# EAGLE design femtoBeacon-BT5_r1.0.1 (EAGLE 7.6.0)

## Sheet 1 of 2
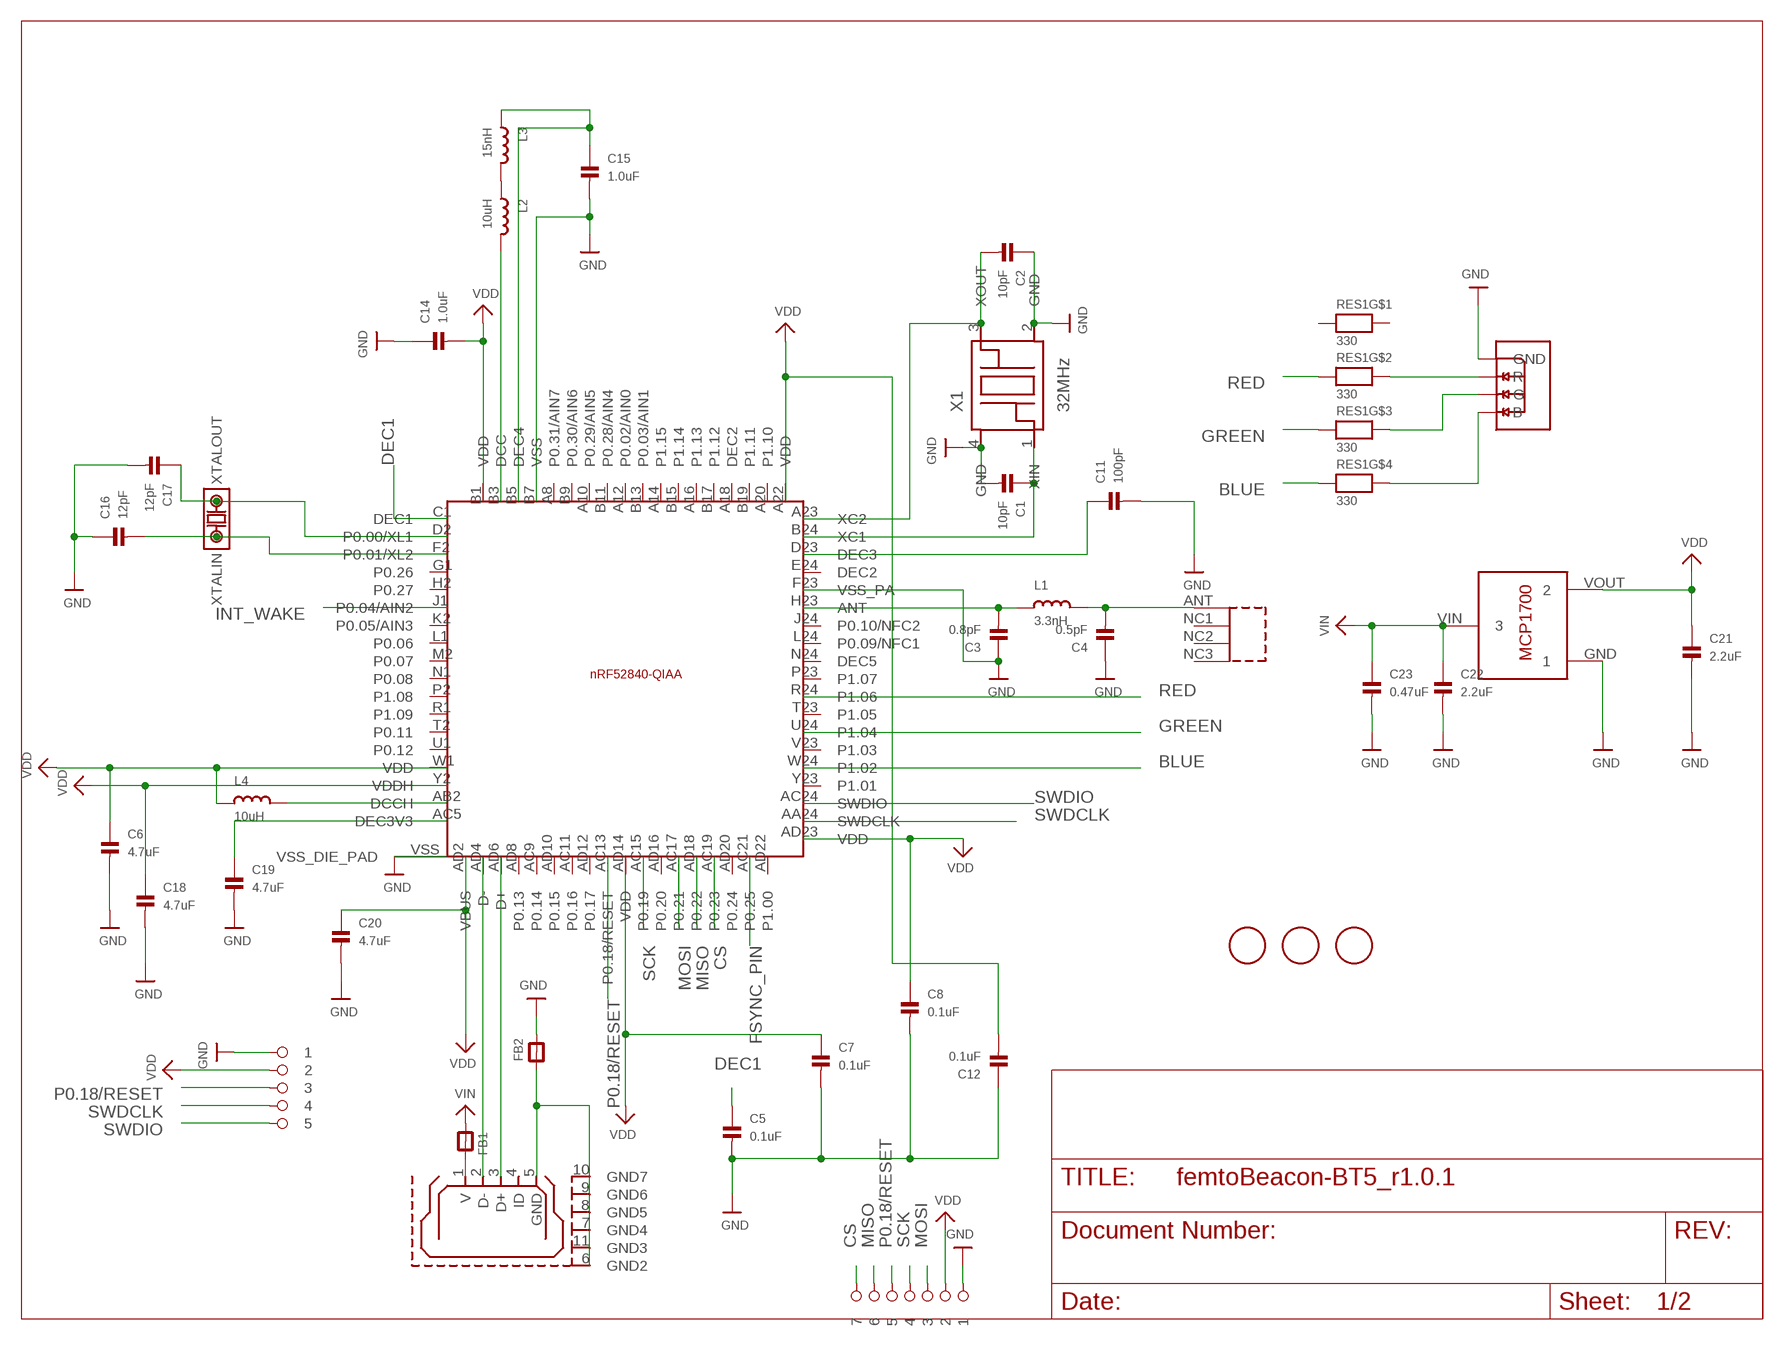
[diagram p0: schematic, sheet 1]

### Parts
ANT  0479480001  [0479480001]
C1  10pF  CAP_CERAMIC_0402MP  [_0402MP]
C2  10pF  CAP_CERAMIC_0402MP  [_0402MP]
C3  0.8pF  CAP_CERAMIC_0402MP  [_0402MP]
C4  0.5pF  CAP_CERAMIC_0402MP  [_0402MP]
C5  0.1uF  CAP_CERAMIC_0402MP  [_0402MP]
C6  4.7uF  CAP_CERAMIC_0402MP  [_0402MP]
C7  0.1uF  CAP_CERAMIC_0402MP  [_0402MP]
C8  0.1uF  CAP_CERAMIC_0402MP  [_0402MP]
C11  100pF  CAP_CERAMIC_0402MP  [_0402MP]
C12  0.1uF  CAP_CERAMIC_0402MP  [_0402MP]
C14  1.0uF  CAP_CERAMIC_0402MP  [_0402MP]
C15  1.0uF  CAP_CERAMIC_0402MP  [_0402MP]
C16  12pF  CAP_CERAMIC_0402MP  [_0402MP]
C17  12pF  CAP_CERAMIC_0402MP  [_0402MP]
C18  4.7uF  CAP_CERAMIC_0402MP  [_0402MP]
C19  4.7uF  CAP_CERAMIC_0402MP  [_0402MP]
C20  4.7uF  CAP_CERAMIC_0402MP  [_0402MP]
C21  2.2uF  CAP_CERAMIC_0402MP  [_0402MP]
C22  2.2uF  CAP_CERAMIC_0402MP  [_0402MP]
C23  0.47uF  CAP_CERAMIC_0402MP  [_0402MP]
FB1  FERRITE_0603MP  [_0603MP]
FB2  FERRITE_0603MP  [_0603MP]
FID1  FIDUCIAL  [FIDUCIAL_1MM]
FID2  FIDUCIAL  [FIDUCIAL_1MM]
FID3  FIDUCIAL  [FIDUCIAL_1MM]
IC  NRF52840  [NRF52840]
L1  3.3nH  INDUCTOR_0402MP  [_0402MP]
L2  10uH  INDUCTOR_0402MP  [_0402MP]
L3  15nH  INDUCTOR_0402MP  [_0402MP]
L4  10uH  INDUCTOR_0402MP  [_0402MP]
LDO_VREG  MCP1700T-3302E/TT  [MCP1700T-3302E/TT]
RES1  330  RESISTOR_4PACK  [RESPACK_4X0603]
U$1  1X5_ROUND  [1X5_ROUND]
U$7  LRTB_R48G  [LRTB_R48G]
U$27  1X7_ROUND  [1X7_ROUND]
USB  USB_MICROB  [USB_MICROB_PACKAGE]
X1  32MHz  FA-128  [FA-128]
X2  32.768kHZ  ABS06-107-32.768KHZ-T  [ABS06-107-32.768KHZ-T]

### Nets
ANT: C3.2 IC.H23(ANT) L1.1
BLUE: IC.W24(P1.02) RES1.4
CS: IC.AC19(P0.23) U$27.P$7 ; also sheet 2
D23: C11.1 IC.D23(DEC3)
DCCH: IC.AB2(DCCH) L4.2
DEC1: C5.1 IC.C1(DEC1)
DEC3V3: C19.1 IC.AC5(DEC3V3)
FSYNC_PIN: IC.AC21(P0.25) ; also sheet 2
GND: C1.2 C2.1 C3.1 C4.1 C5.2 C6.2 C7.2 C8.2 C11.2 C12.1 C14.1 C15.2 C16.1 C17.2 C18.2 C19.2 C20.2 C21.2 C22.2 C23.2 FB2.2 IC.B7(VSS) IC.F23(VSS_PA) IC.VSS(VSS_DIE_PAD) LDO_VREG.GND U$1.P$1 U$7.1(GND) U$27.P$1 X1.2(GND) X1.4(GND) ; also sheet 2
GND_IN: FB2.1 USB.5(GND) USB.6(GND2) USB.7(GND4) USB.8(GND5) USB.9(GND6) USB.10(GND7) USB.11(GND3)
GREEN: IC.U24(P1.04) RES1.3
INT_WAKE: IC.J1(P0.04/AIN2) ; also sheet 2
MISO: IC.AD18(P0.22) U$27.P$6 ; also sheet 2
MOSI: IC.AC17(P0.21) U$27.P$3 ; also sheet 2
N$1: FB1.2 USB.1(V)
N$12: RES1.5 U$7.4(B)
N$13: RES1.6 U$7.3(G)
N$14: RES1.7 U$7.2(R)
N$20: IC.B3(DCC) L2.2
N$21: L2.1 L3.2
N$22: C15.1 IC.B5(DEC4) L3.1
P0.18/RESET: IC.AC13(P0.18/RESET) U$1.P$3 U$27.P$5
RED: IC.R24(P1.06) RES1.2
RF: ANT.ANT C4.2 L1.2
SCK: IC.AC15(P0.19) U$27.P$4 ; also sheet 2
SWDCLK: IC.AA24(SWDCLK) U$1.P$4
SWDIO: IC.AC24(SWDIO) U$1.P$5
USB_DM: IC.AD4(D-) USB.2(D-)
USB_DP: IC.AD6(D+) USB.3(D+)
VDD: C6.1 C7.1 C8.1 C12.2 C14.2 C18.1 C20.1 C21.1 IC.A22(VDD) IC.AD2(VBUS) IC.AD14(VDD) IC.AD23(VDD) IC.B1(VDD) IC.W1(VDD) IC.Y2(VDDH) L4.1 LDO_VREG.VOUT U$1.P$2 U$27.P$2 ; also sheet 2
VIN: C22.1 C23.1 FB1.1 LDO_VREG.VIN
XC1: C1.1 IC.B24(XC1) X1.1(XIN)
XC2: C2.2 IC.A23(XC2) X1.3(XOUT)
XL1: C17.1 IC.D2(P0.00/XL1) X2.2(XTALOUT)
XL2: C16.2 IC.F2(P0.01/XL2) X2.1(XTALIN)
Unconnected: ANT.NC1 ANT.NC2 ANT.NC3 IC.A8(P0.31/AIN7) IC.A10(P0.29/AIN5) IC.A12(P0.02/AIN0) IC.A14(P1.15) IC.A16(P1.13) IC.A18(DEC2) IC.A20(P1.10) IC.AC9(P0.14) IC.AC11(P0.16) IC.AD8(P0.13) IC.AD10(P0.15) IC.AD12(P0.17) IC.AD16(P0.20) IC.AD20(P0.24) IC.AD22(P1.00) IC.B9(P0.30/AIN6) IC.B11(P0.28/AIN4) IC.B13(P0.03/AIN1) IC.B15(P1.14) IC.B17(P1.12) IC.B19(P1.11) IC.E24(DEC2) IC.G1(P0.26) IC.H2(P0.27) IC.J24(P0.10/NFC2) IC.K2(P0.05/AIN3) IC.L1(P0.06) IC.L24(P0.09/NFC1) IC.M2(P0.07) IC.N1(P0.08) IC.N24(DEC5) IC.P2(P1.08) IC.P23(P1.07) IC.R1(P1.09) IC.T2(P0.11) IC.T23(P1.05) IC.U1(P0.12) IC.V23(P1.03) IC.Y23(P1.01) RES1.1 RES1.8 USB.4(ID)

## Sheet 2 of 2
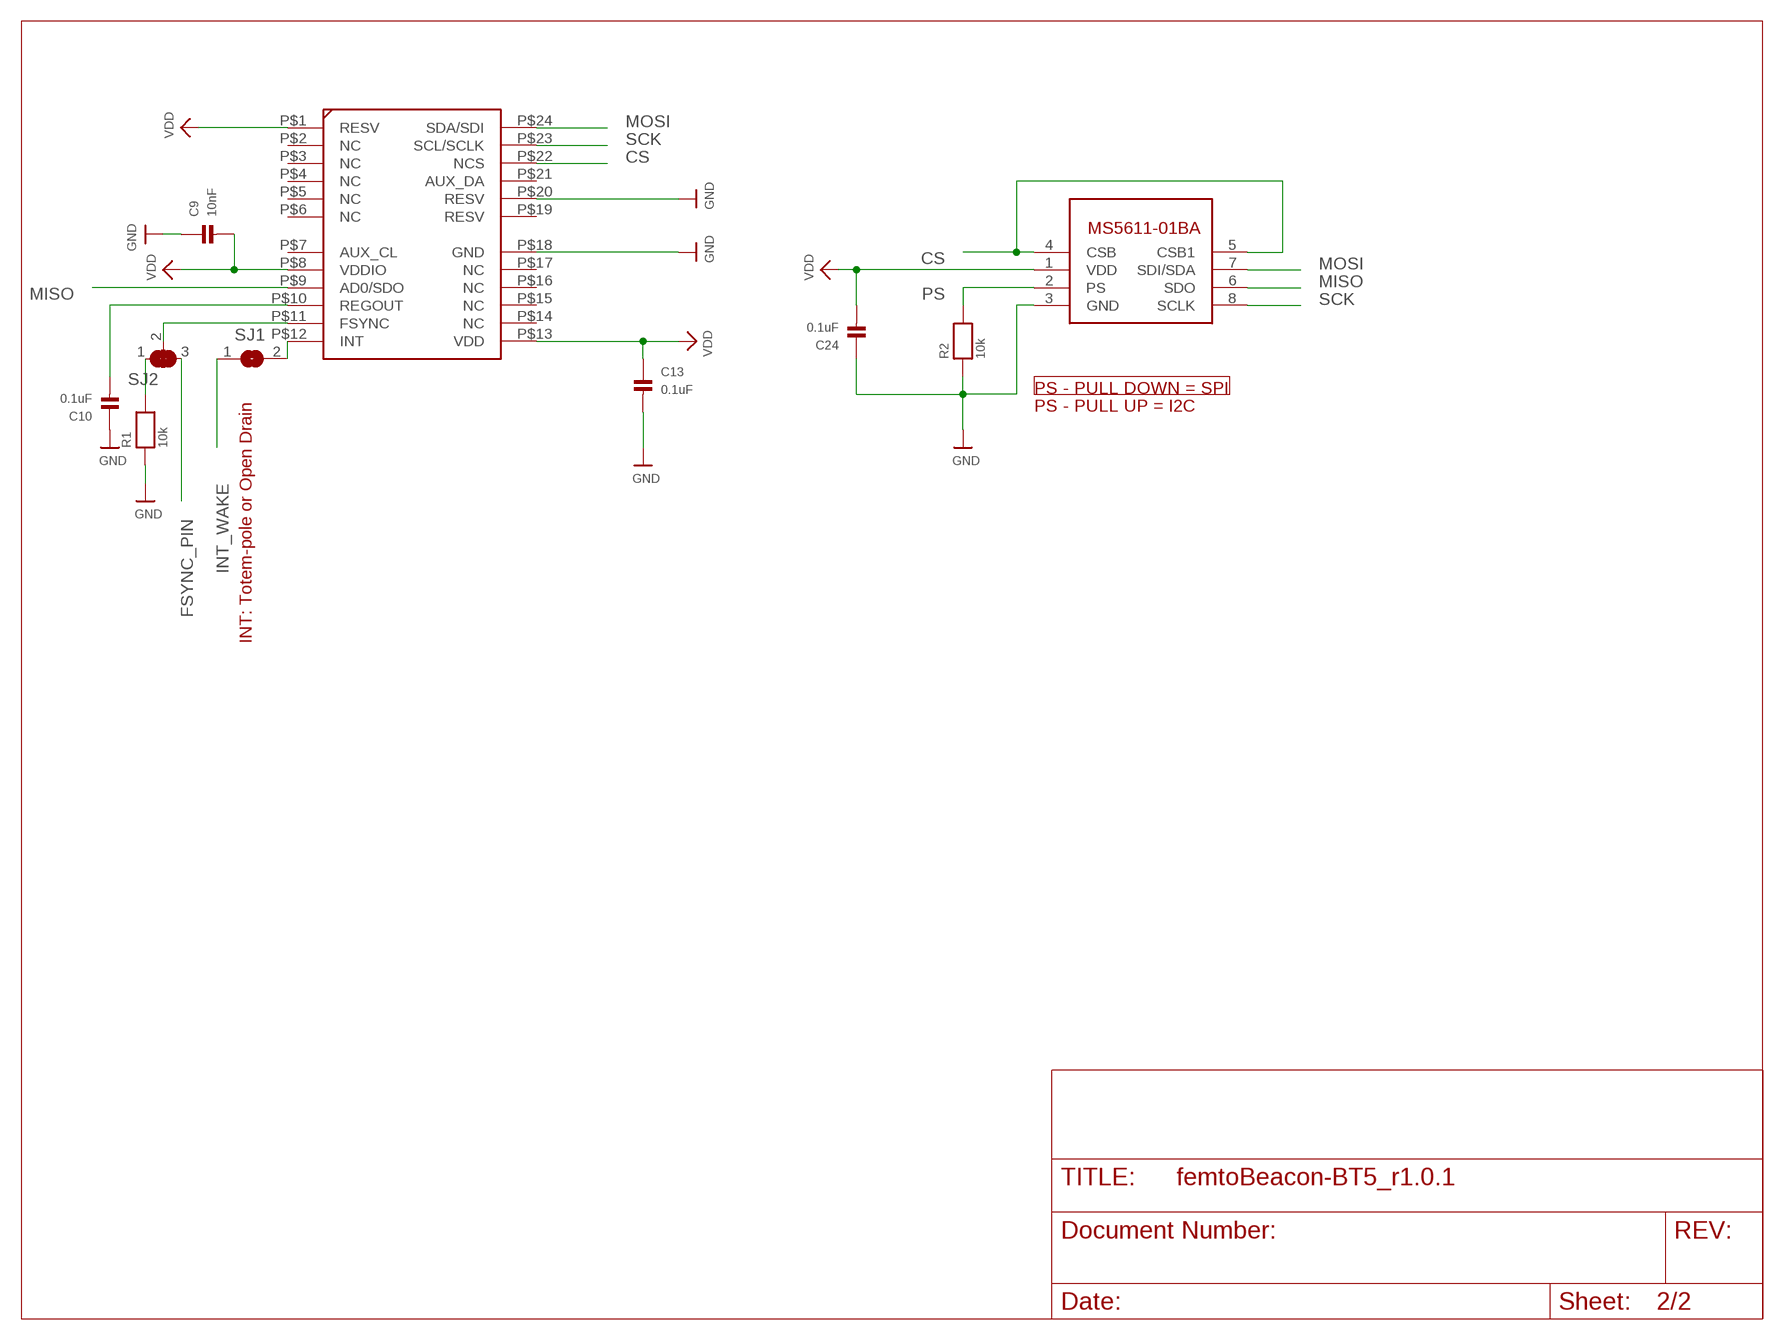
[diagram p1: schematic, sheet 2]

### Parts
BARO  MS5611-01BA03  [MS5611-01BA03]
C9  10nF  CAP_CERAMIC_0402MP  [_0402MP]
C10  0.1uF  CAP_CERAMIC_0402MP  [_0402MP]
C13  0.1uF  CAP_CERAMIC_0402MP  [_0402MP]
C24  0.1uF  CAP_CERAMIC_0402MP  [_0402MP]
IMU  MPU-9250  [QFN_3X3MM]
R1  10k  RESISTOR_0402MP  [_0402MP]
R2  10k  RESISTOR_0402MP  [_0402MP]
SJ1  SOLDERJUMPERCLOSED  [SOLDERJUMPER_CLOSEDWIRE]
SJ2  SOLDERJUMPER_2WAY  [SOLDERJUMPER_2WAY_OPEN_NOPASTE]

### Nets
CS: BARO.4(CSB) BARO.5(CSB1) IMU.P$22(NCS) ; also sheet 1
FSYNC: IMU.P$11(FSYNC) SJ2.2
FSYNC_PIN: SJ2.3 ; also sheet 1
GND: BARO.3(GND) C9.1 C10.1 C13.2 C24.1 IMU.P$18(GND) IMU.P$20(RESV) R1.1 R2.1 ; also sheet 1
INT: IMU.P$12(INT) SJ1.2
INT_WAKE: SJ1.1 ; also sheet 1
MISO: BARO.6(SDO) IMU.P$9(AD0/SDO) ; also sheet 1
MOSI: BARO.7(SDI/SDA) IMU.P$24(SDA/SDI) ; also sheet 1
N$23: R1.2 SJ2.1
N$25: C10.2 IMU.P$10(REGOUT)
PS: BARO.2(PS) R2.2
SCK: BARO.8(SCLK) IMU.P$23(SCL/SCLK) ; also sheet 1
VDD: BARO.1(VDD) C9.2 C13.1 C24.2 IMU.P$1(RESV) IMU.P$8(VDDIO) IMU.P$13(VDD) ; also sheet 1
Unconnected: IMU.P$2(NC) IMU.P$3(NC) IMU.P$4(NC) IMU.P$5(NC) IMU.P$6(NC) IMU.P$7(AUX_CL) IMU.P$14(NC) IMU.P$15(NC) IMU.P$16(NC) IMU.P$17(NC) IMU.P$19(RESV) IMU.P$21(AUX_DA)

### Notes on the sheet
- PS - PULL DOWN = SPI
- PS - PULL UP = I2C
- INT: Totem-pole or Open Drain

## Library data of the parts
ANT = molex-antenna-2.4GHz:0479480001
BARO = freeimu:MS5611-01BA03
C1 C2 C9 C10 C13 C16 C17 C24 = microbuilder:CAP_CERAMIC: Ceramic Capacitors 0402 - 0402 Surface Mount Capacitors 16pF 50V 5% [Digikey: 445-4899-2-ND] 18pF 50V 5% [Digikey: 490-1281-2-ND] 22pF 50V 5% [Digikey: 490-1283-2-ND] 68pF 50V 5% [Digikey: 490-1289-2-ND] 0.1uF 10V 10% [Digikey: 490-1318-2-ND] 1.0uF 6.3V 10% [Digikey: 490-1320-2-ND] 0603 - 0603 Surface Mount Capacitors 16 pF 50V 5% [Digikey: 445-5051-2-ND] 22 pF 50V [Digikey: PCC220ACVTR-ND] 33 pF 50V 5% [Digikey: 490-1415-1-ND] 56pF 50V 5% [Digikey: 490-1421-1-ND] 220pF 50V 5% [Digikey: 445-1285-1-ND] 680 pF 50V 2200 pF 50V 5% C0G [Digikey: 445-1297-1-ND] 5600 pF 100V 5% X7R [Digikey: 478-3711-1-ND] 0.1 µF 25V 10% [Digikey: PCC2277TR-ND] 0.22 µF 16V 10% X7R [Digikey: 445-1318-1-ND] 1.0 µF 25V 10% [Digikey: 445-5146-2-ND] 0603 - RF Specific 3pF 250V +/-0.1pF RF [Digikey: 712-1347-1-ND] 18 pF 250V 5% [Digikey: 478-3505-1-ND or 712-1322-1-ND] 56 pF 250V 5% C0G RF [Digikey: 490-4867-1-ND] 68 pF 250V RF [Digikey: 490-4868-1-ND] 0805 - 0805 Surface Mount Capacitors 220 pF 250V 2% RF Ceramic Capacitor [Digikey: 712-1398-1-ND] 1000 pF 50V 2% NP0 Ceramic Capacitor [Digikey: 478-3760-1-ND] 0.1 µF 25V 10% Ceramic Capacitor [Digikey: PCC1828TR-ND] 1.0 µF 16V 10% Ceramic Capacitor[Digikey: 490-1691-2-ND] 10.0 µF 10V 10% Ceramic Capacitor[Digikey: 709-1228-1-ND] 10.0 uF 16V 10% Ceramic Capacitor [Digikey: 478-5165-2-ND] 47 uF 6.3V 20% Ceramic Capacitor [Digikey: 587-1779-1-ND or 399-5506-1-ND] 1206 - 1206 Surface Mount Capacitors 47uF 10V 20% Ceramic Capacitor [Digikey: 490-5528-1-ND or 399-5508-1-ND or 445-6010-1-ND] 100uF 6.3V -20%, +80% Y5V Ceramic Capacitor (Digikey: 490-4512-1-ND, Mouser: 81-GRM31CF50J107ZE1L); TOL: NP0, ±2%
C3 C11 = microbuilder:CAP_CERAMIC: Ceramic Capacitors 0402 - 0402 Surface Mount Capacitors 16pF 50V 5% [Digikey: 445-4899-2-ND] 18pF 50V 5% [Digikey: 490-1281-2-ND] 22pF 50V 5% [Digikey: 490-1283-2-ND] 68pF 50V 5% [Digikey: 490-1289-2-ND] 0.1uF 10V 10% [Digikey: 490-1318-2-ND] 1.0uF 6.3V 10% [Digikey: 490-1320-2-ND] 0603 - 0603 Surface Mount Capacitors 16 pF 50V 5% [Digikey: 445-5051-2-ND] 22 pF 50V [Digikey: PCC220ACVTR-ND] 33 pF 50V 5% [Digikey: 490-1415-1-ND] 56pF 50V 5% [Digikey: 490-1421-1-ND] 220pF 50V 5% [Digikey: 445-1285-1-ND] 680 pF 50V 2200 pF 50V 5% C0G [Digikey: 445-1297-1-ND] 5600 pF 100V 5% X7R [Digikey: 478-3711-1-ND] 0.1 µF 25V 10% [Digikey: PCC2277TR-ND] 0.22 µF 16V 10% X7R [Digikey: 445-1318-1-ND] 1.0 µF 25V 10% [Digikey: 445-5146-2-ND] 0603 - RF Specific 3pF 250V +/-0.1pF RF [Digikey: 712-1347-1-ND] 18 pF 250V 5% [Digikey: 478-3505-1-ND or 712-1322-1-ND] 56 pF 250V 5% C0G RF [Digikey: 490-4867-1-ND] 68 pF 250V RF [Digikey: 490-4868-1-ND] 0805 - 0805 Surface Mount Capacitors 220 pF 250V 2% RF Ceramic Capacitor [Digikey: 712-1398-1-ND] 1000 pF 50V 2% NP0 Ceramic Capacitor [Digikey: 478-3760-1-ND] 0.1 µF 25V 10% Ceramic Capacitor [Digikey: PCC1828TR-ND] 1.0 µF 16V 10% Ceramic Capacitor[Digikey: 490-1691-2-ND] 10.0 µF 10V 10% Ceramic Capacitor[Digikey: 709-1228-1-ND] 10.0 uF 16V 10% Ceramic Capacitor [Digikey: 478-5165-2-ND] 47 uF 6.3V 20% Ceramic Capacitor [Digikey: 587-1779-1-ND or 399-5506-1-ND] 1206 - 1206 Surface Mount Capacitors 47uF 10V 20% Ceramic Capacitor [Digikey: 490-5528-1-ND or 399-5508-1-ND or 445-6010-1-ND] 100uF 6.3V -20%, +80% Y5V Ceramic Capacitor (Digikey: 490-4512-1-ND, Mouser: 81-GRM31CF50J107ZE1L); TOL: NP0, ±5%
C4 = microbuilder:CAP_CERAMIC: Ceramic Capacitors 0402 - 0402 Surface Mount Capacitors 16pF 50V 5% [Digikey: 445-4899-2-ND] 18pF 50V 5% [Digikey: 490-1281-2-ND] 22pF 50V 5% [Digikey: 490-1283-2-ND] 68pF 50V 5% [Digikey: 490-1289-2-ND] 0.1uF 10V 10% [Digikey: 490-1318-2-ND] 1.0uF 6.3V 10% [Digikey: 490-1320-2-ND] 0603 - 0603 Surface Mount Capacitors 16 pF 50V 5% [Digikey: 445-5051-2-ND] 22 pF 50V [Digikey: PCC220ACVTR-ND] 33 pF 50V 5% [Digikey: 490-1415-1-ND] 56pF 50V 5% [Digikey: 490-1421-1-ND] 220pF 50V 5% [Digikey: 445-1285-1-ND] 680 pF 50V 2200 pF 50V 5% C0G [Digikey: 445-1297-1-ND] 5600 pF 100V 5% X7R [Digikey: 478-3711-1-ND] 0.1 µF 25V 10% [Digikey: PCC2277TR-ND] 0.22 µF 16V 10% X7R [Digikey: 445-1318-1-ND] 1.0 µF 25V 10% [Digikey: 445-5146-2-ND] 0603 - RF Specific 3pF 250V +/-0.1pF RF [Digikey: 712-1347-1-ND] 18 pF 250V 5% [Digikey: 478-3505-1-ND or 712-1322-1-ND] 56 pF 250V 5% C0G RF [Digikey: 490-4867-1-ND] 68 pF 250V RF [Digikey: 490-4868-1-ND] 0805 - 0805 Surface Mount Capacitors 220 pF 250V 2% RF Ceramic Capacitor [Digikey: 712-1398-1-ND] 1000 pF 50V 2% NP0 Ceramic Capacitor [Digikey: 478-3760-1-ND] 0.1 µF 25V 10% Ceramic Capacitor [Digikey: PCC1828TR-ND] 1.0 µF 16V 10% Ceramic Capacitor[Digikey: 490-1691-2-ND] 10.0 µF 10V 10% Ceramic Capacitor[Digikey: 709-1228-1-ND] 10.0 uF 16V 10% Ceramic Capacitor [Digikey: 478-5165-2-ND] 47 uF 6.3V 20% Ceramic Capacitor [Digikey: 587-1779-1-ND or 399-5506-1-ND] 1206 - 1206 Surface Mount Capacitors 47uF 10V 20% Ceramic Capacitor [Digikey: 490-5528-1-ND or 399-5508-1-ND or 445-6010-1-ND] 100uF 6.3V -20%, +80% Y5V Ceramic Capacitor (Digikey: 490-4512-1-ND, Mouser: 81-GRM31CF50J107ZE1L); TOL: NP0, ±10%
C5 C7 C8 C12 C18 C19 C21-C23 = microbuilder:CAP_CERAMIC: Ceramic Capacitors 0402 - 0402 Surface Mount Capacitors 16pF 50V 5% [Digikey: 445-4899-2-ND] 18pF 50V 5% [Digikey: 490-1281-2-ND] 22pF 50V 5% [Digikey: 490-1283-2-ND] 68pF 50V 5% [Digikey: 490-1289-2-ND] 0.1uF 10V 10% [Digikey: 490-1318-2-ND] 1.0uF 6.3V 10% [Digikey: 490-1320-2-ND] 0603 - 0603 Surface Mount Capacitors 16 pF 50V 5% [Digikey: 445-5051-2-ND] 22 pF 50V [Digikey: PCC220ACVTR-ND] 33 pF 50V 5% [Digikey: 490-1415-1-ND] 56pF 50V 5% [Digikey: 490-1421-1-ND] 220pF 50V 5% [Digikey: 445-1285-1-ND] 680 pF 50V 2200 pF 50V 5% C0G [Digikey: 445-1297-1-ND] 5600 pF 100V 5% X7R [Digikey: 478-3711-1-ND] 0.1 µF 25V 10% [Digikey: PCC2277TR-ND] 0.22 µF 16V 10% X7R [Digikey: 445-1318-1-ND] 1.0 µF 25V 10% [Digikey: 445-5146-2-ND] 0603 - RF Specific 3pF 250V +/-0.1pF RF [Digikey: 712-1347-1-ND] 18 pF 250V 5% [Digikey: 478-3505-1-ND or 712-1322-1-ND] 56 pF 250V 5% C0G RF [Digikey: 490-4867-1-ND] 68 pF 250V RF [Digikey: 490-4868-1-ND] 0805 - 0805 Surface Mount Capacitors 220 pF 250V 2% RF Ceramic Capacitor [Digikey: 712-1398-1-ND] 1000 pF 50V 2% NP0 Ceramic Capacitor [Digikey: 478-3760-1-ND] 0.1 µF 25V 10% Ceramic Capacitor [Digikey: PCC1828TR-ND] 1.0 µF 16V 10% Ceramic Capacitor[Digikey: 490-1691-2-ND] 10.0 µF 10V 10% Ceramic Capacitor[Digikey: 709-1228-1-ND] 10.0 uF 16V 10% Ceramic Capacitor [Digikey: 478-5165-2-ND] 47 uF 6.3V 20% Ceramic Capacitor [Digikey: 587-1779-1-ND or 399-5506-1-ND] 1206 - 1206 Surface Mount Capacitors 47uF 10V 20% Ceramic Capacitor [Digikey: 490-5528-1-ND or 399-5508-1-ND or 445-6010-1-ND] 100uF 6.3V -20%, +80% Y5V Ceramic Capacitor (Digikey: 490-4512-1-ND, Mouser: 81-GRM31CF50J107ZE1L)
C6 C14 C15 C20 = microbuilder:CAP_CERAMIC: Ceramic Capacitors 0402 - 0402 Surface Mount Capacitors 16pF 50V 5% [Digikey: 445-4899-2-ND] 18pF 50V 5% [Digikey: 490-1281-2-ND] 22pF 50V 5% [Digikey: 490-1283-2-ND] 68pF 50V 5% [Digikey: 490-1289-2-ND] 0.1uF 10V 10% [Digikey: 490-1318-2-ND] 1.0uF 6.3V 10% [Digikey: 490-1320-2-ND] 0603 - 0603 Surface Mount Capacitors 16 pF 50V 5% [Digikey: 445-5051-2-ND] 22 pF 50V [Digikey: PCC220ACVTR-ND] 33 pF 50V 5% [Digikey: 490-1415-1-ND] 56pF 50V 5% [Digikey: 490-1421-1-ND] 220pF 50V 5% [Digikey: 445-1285-1-ND] 680 pF 50V 2200 pF 50V 5% C0G [Digikey: 445-1297-1-ND] 5600 pF 100V 5% X7R [Digikey: 478-3711-1-ND] 0.1 µF 25V 10% [Digikey: PCC2277TR-ND] 0.22 µF 16V 10% X7R [Digikey: 445-1318-1-ND] 1.0 µF 25V 10% [Digikey: 445-5146-2-ND] 0603 - RF Specific 3pF 250V +/-0.1pF RF [Digikey: 712-1347-1-ND] 18 pF 250V 5% [Digikey: 478-3505-1-ND or 712-1322-1-ND] 56 pF 250V 5% C0G RF [Digikey: 490-4867-1-ND] 68 pF 250V RF [Digikey: 490-4868-1-ND] 0805 - 0805 Surface Mount Capacitors 220 pF 250V 2% RF Ceramic Capacitor [Digikey: 712-1398-1-ND] 1000 pF 50V 2% NP0 Ceramic Capacitor [Digikey: 478-3760-1-ND] 0.1 µF 25V 10% Ceramic Capacitor [Digikey: PCC1828TR-ND] 1.0 µF 16V 10% Ceramic Capacitor[Digikey: 490-1691-2-ND] 10.0 µF 10V 10% Ceramic Capacitor[Digikey: 709-1228-1-ND] 10.0 uF 16V 10% Ceramic Capacitor [Digikey: 478-5165-2-ND] 47 uF 6.3V 20% Ceramic Capacitor [Digikey: 587-1779-1-ND or 399-5506-1-ND] 1206 - 1206 Surface Mount Capacitors 47uF 10V 20% Ceramic Capacitor [Digikey: 490-5528-1-ND or 399-5508-1-ND or 445-6010-1-ND] 100uF 6.3V -20%, +80% Y5V Ceramic Capacitor (Digikey: 490-4512-1-ND, Mouser: 81-GRM31CF50J107ZE1L); TOL: X7R, ±10%
FB1 FB2 = microbuilder:FERRITE: Ferrite Bead 0603 MMZ1608B121C - 120 Ohm @ 100MHz, 600mA, 0.15 Ohm DC Resistance - Digikey: 445-2164-1-ND BK1608HW121-T - 120 Ohm, 600mA Ferrite Chip - Digikey: 587-1876-2-ND 0805 HZ0805B272R-10 - 2.7K Ohm @ 100MHz, 200mA, 0.8 Ohm DC Resistance - Digikey: 240-2504-1-ND (see also Murata BLM21BD272SN1L) MMZ2012Y152B - 1.5K Ohm @ 100MHz, 500mA, 0.4 Ohm DC Resistance - Digikey: 445-1560-1-ND - Mainly for high frequency (80-400MHz) MMZ2012R102A - 1K Ohm @ 100MHz, 500mA, 0.3 Ohm DC Resistance - Digikey: 445-1555-2-ND - More general purpose (10-200MHz)
FID1-FID3 = adafruit:FIDUCIAL: For use by pick and place machines to calibrate the vision/machine, 1mm By microbuilder.eu
IC = Nordic_NRF52840:NRF52840
IMU = mpu9250:MPU-9250
L1 = microbuilder:INDUCTOR: Inductors 0603: 10nH Ceramic Inductor - microwire antenna/RF (Digikey: 712-1434-2-ND) 0805: 560nH Ceramic Inductor - RF (Digikey: 553-1047-1-ND) 270nH Ceramic Inductor - Q = 40@250MHz, +-5%, 1 Ohm DC Resistance (Digikey: 535-10506-2-ND) 1007 (2518 Metric) SMT: 10µH 10% 250mOhm 820mA 1007 Inductor (Digikey: 587-2189-1-ND) 22µH 10% 500mOhm 580mA 1007 Inductor (Digikey: 587-2190-1-ND) 47µH 10% 950mOhm 420mA 1007 Inductor (Digikey: 587-2191-1-ND) 47µH 5% 100mOhm 1A 1008 Inductor (Digikey: 732-1816-1-ND) 5.0x5.0mm (Taiyo Yuden NR5040 Series) 6.8µH 20% 2.3A 64mOhm Inductor (Digikey: 587-2374-2-ND) 5.0x5.0mm (TDK VLC5045 Series) 4.7µH 20% 3.3A 34mOhm Inductor (Digikey: 445-6526-1-ND) 6.8µH 20% 2.7A 46mOhm Inductor (Digikey: 445-6527-1-ND) 6.0x6.0mm (TDK VLC6045 Series) 4.7µH 20% 3.8A 27mOhm Inductor (Digikey: 445-6538-2-ND) 6.8µH 20% 3A 41mOhm Inductor (Digikey: 445-6540-1-ND) 6.2µH 30% 2.2A 45mOhm Inductor (Digikey: SRR5028-6R2YCT-ND) - Not TDK VLC6045 but footprint should match 6.0x6.0mm (TDK SLF6045 Series) 6.8uH 30% 2A 33mOhm Inductor (Digikey: 445-4572-1-ND, Mouser: 810-SLF645T6R8N2R0PF); TOL: ±5%
L2 = microbuilder:INDUCTOR: Inductors 0603: 10nH Ceramic Inductor - microwire antenna/RF (Digikey: 712-1434-2-ND) 0805: 560nH Ceramic Inductor - RF (Digikey: 553-1047-1-ND) 270nH Ceramic Inductor - Q = 40@250MHz, +-5%, 1 Ohm DC Resistance (Digikey: 535-10506-2-ND) 1007 (2518 Metric) SMT: 10µH 10% 250mOhm 820mA 1007 Inductor (Digikey: 587-2189-1-ND) 22µH 10% 500mOhm 580mA 1007 Inductor (Digikey: 587-2190-1-ND) 47µH 10% 950mOhm 420mA 1007 Inductor (Digikey: 587-2191-1-ND) 47µH 5% 100mOhm 1A 1008 Inductor (Digikey: 732-1816-1-ND) 5.0x5.0mm (Taiyo Yuden NR5040 Series) 6.8µH 20% 2.3A 64mOhm Inductor (Digikey: 587-2374-2-ND) 5.0x5.0mm (TDK VLC5045 Series) 4.7µH 20% 3.3A 34mOhm Inductor (Digikey: 445-6526-1-ND) 6.8µH 20% 2.7A 46mOhm Inductor (Digikey: 445-6527-1-ND) 6.0x6.0mm (TDK VLC6045 Series) 4.7µH 20% 3.8A 27mOhm Inductor (Digikey: 445-6538-2-ND) 6.8µH 20% 3A 41mOhm Inductor (Digikey: 445-6540-1-ND) 6.2µH 30% 2.2A 45mOhm Inductor (Digikey: SRR5028-6R2YCT-ND) - Not TDK VLC6045 but footprint should match 6.0x6.0mm (TDK SLF6045 Series) 6.8uH 30% 2A 33mOhm Inductor (Digikey: 445-4572-1-ND, Mouser: 810-SLF645T6R8N2R0PF); TOL: Chip inductor, IDC min = 50 mA, ±20%
L3 = microbuilder:INDUCTOR: Inductors 0603: 10nH Ceramic Inductor - microwire antenna/RF (Digikey: 712-1434-2-ND) 0805: 560nH Ceramic Inductor - RF (Digikey: 553-1047-1-ND) 270nH Ceramic Inductor - Q = 40@250MHz, +-5%, 1 Ohm DC Resistance (Digikey: 535-10506-2-ND) 1007 (2518 Metric) SMT: 10µH 10% 250mOhm 820mA 1007 Inductor (Digikey: 587-2189-1-ND) 22µH 10% 500mOhm 580mA 1007 Inductor (Digikey: 587-2190-1-ND) 47µH 10% 950mOhm 420mA 1007 Inductor (Digikey: 587-2191-1-ND) 47µH 5% 100mOhm 1A 1008 Inductor (Digikey: 732-1816-1-ND) 5.0x5.0mm (Taiyo Yuden NR5040 Series) 6.8µH 20% 2.3A 64mOhm Inductor (Digikey: 587-2374-2-ND) 5.0x5.0mm (TDK VLC5045 Series) 4.7µH 20% 3.3A 34mOhm Inductor (Digikey: 445-6526-1-ND) 6.8µH 20% 2.7A 46mOhm Inductor (Digikey: 445-6527-1-ND) 6.0x6.0mm (TDK VLC6045 Series) 4.7µH 20% 3.8A 27mOhm Inductor (Digikey: 445-6538-2-ND) 6.8µH 20% 3A 41mOhm Inductor (Digikey: 445-6540-1-ND) 6.2µH 30% 2.2A 45mOhm Inductor (Digikey: SRR5028-6R2YCT-ND) - Not TDK VLC6045 but footprint should match 6.0x6.0mm (TDK SLF6045 Series) 6.8uH 30% 2A 33mOhm Inductor (Digikey: 445-4572-1-ND, Mouser: 810-SLF645T6R8N2R0PF); TOL: High frequency chip inductor ±10%
L4 = microbuilder:INDUCTOR: Inductors 0603: 10nH Ceramic Inductor - microwire antenna/RF (Digikey: 712-1434-2-ND) 0805: 560nH Ceramic Inductor - RF (Digikey: 553-1047-1-ND) 270nH Ceramic Inductor - Q = 40@250MHz, +-5%, 1 Ohm DC Resistance (Digikey: 535-10506-2-ND) 1007 (2518 Metric) SMT: 10µH 10% 250mOhm 820mA 1007 Inductor (Digikey: 587-2189-1-ND) 22µH 10% 500mOhm 580mA 1007 Inductor (Digikey: 587-2190-1-ND) 47µH 10% 950mOhm 420mA 1007 Inductor (Digikey: 587-2191-1-ND) 47µH 5% 100mOhm 1A 1008 Inductor (Digikey: 732-1816-1-ND) 5.0x5.0mm (Taiyo Yuden NR5040 Series) 6.8µH 20% 2.3A 64mOhm Inductor (Digikey: 587-2374-2-ND) 5.0x5.0mm (TDK VLC5045 Series) 4.7µH 20% 3.3A 34mOhm Inductor (Digikey: 445-6526-1-ND) 6.8µH 20% 2.7A 46mOhm Inductor (Digikey: 445-6527-1-ND) 6.0x6.0mm (TDK VLC6045 Series) 4.7µH 20% 3.8A 27mOhm Inductor (Digikey: 445-6538-2-ND) 6.8µH 20% 3A 41mOhm Inductor (Digikey: 445-6540-1-ND) 6.2µH 30% 2.2A 45mOhm Inductor (Digikey: SRR5028-6R2YCT-ND) - Not TDK VLC6045 but footprint should match 6.0x6.0mm (TDK SLF6045 Series) 6.8uH 30% 2A 33mOhm Inductor (Digikey: 445-4572-1-ND, Mouser: 810-SLF645T6R8N2R0PF); TOL: Chip inductor, IDC min = 80 mA, ±10%
LDO_VREG = MCP1700T-3302E_TT:MCP1700T-3302E/TT: Microchip LDO "MCP1700" in a 3-Pin SOT-23 package. ID: MCP1700T-3302E/TT
R1 R2 = microbuilder:RESISTOR: Resistors 0402 - 0402 Surface Mount Package 22 Ohm 1% 1/16W [Digikey: 311-22.0LRTR-ND] 33 Ohm 5% 1/16W 1.0K 5% 1/16W 1.5K 5% 1/16W 2.0K 1% 1/16W 10.0K 1% 1/16W [Digikey: 311-10.0KLRTR-ND] 10.0K 5% 1/16W [Digikey: RMCF0402JT10K0TR-ND] 12.1K 1% 1/16W [Digikey: 311-22.0LRTR-ND] 100.0K 5% 1/16W 0603 - 0603 Surface Mount Package 0 Ohm 1/10 Watt 1% Resistor 15 Ohm 1/10 Watt 1% Resistor 33 Ohm 1/10 Watt 1% Resistor 49.9 Ohm 1/10 Watt 1% Resistor 100 Ohm 1/10 Watt 1% Resistor 150 Ohm 1/10 Watt 1% Resistor 240 Ohm 1/10 Watt 1% Resistor 390 Ohm 1/10 Watt 1% Resistor 560 Ohm 1/10 Watt 1% Resistor 680 Ohm 1/10 Watt 1% Resistor 750 Ohm 1/10 Watt 1% Resistor 1.0K Ohm 1/10 Watt 1% Resistor 1.5K Ohm 1/10 Watt 1% Resistor 2.0K Ohm 1/10 Watt 1% Resistor 2.2K Ohm 1/10 Watt 1% Resistor 3.3K Ohm 1/10 Watt 1% Resistor 4.7K Ohm 1/10 Watt 1% Resistor 10.0K Ohm 1/10 Watt 1% Resistor 12.0K Ohm 1/10 Watt 1% Resistor 12.1K Ohm 1/10 Watt 1% Resistor 20.0K Ohm 1/10 Watt 1% Resistor 33.0K Ohm 1/10 Watt 1% Resistor 100.0K Ohm 1/10 Watt 1% Resistor 0805 - 0805 Surface Mount Package 0 Ohm 1/8 Watt 1% Resistor 33 Ohm 1/8 Watt 1% Resistor 100 Ohm 1/8 Watt 1% Resistor 150 Ohm 1/8 Watt 1% Resistor 200 Ohm 1/8 Watt 1% Resistor 240 Ohm 1/8 Watt 1% Resistor 330 Ohm 1/8 Watt 1% Resistor 390 Ohm 1/8 Watt 1% Resistor 470 Ohm 1/8 Watt 1% Resistor 1.0K Ohm 1/8 Watt 1% Resistor 1.5K Ohm 1/8 Watt 1% Resistor 2.0K Ohm 1/8 Watt 1% Resistor 4.7K Ohm 1/8 Watt 1% Resistor 5.1K Ohm 1/8 Watt 1% Resistor 5.6K Ohm 1/8 Watt 1% Resistor 10.0K Ohm 1/8 Watt 1% Resistor 22.0K Ohm 1/8 Watt 1% Resistor 33.0K Ohm 1/8 Watt 1% Resistor 100K Ohm 1/8 Watt 1% Resistor 1206 - 1206 Surface Mount Package 2012 - 2010 Surface Mount Package 0.11 Ohm 1/2 Watt 1% Resistor - Digikey: RHM.11UCT-ND
RES1 = microbuilder:RESISTOR_4PACK: Resistor Packs (4 resistors) 4 x 0603 10K 1/16W - Digikey: YC164J-10KCT-ND; MFN_ID: 741C083331JP
SJ1 = microbuilder:SOLDERJUMPER: SMD Solder JUMPER Solder the two pads together to create a connection, or remove the solder to break it. REFLOW - Use this footprint for solder paste and reflow ovens. WAVE - Use this footprint for hand-soldering (larger pads). CLOSED - Has a trace between the two pads to ensure it is closed by default. The trace needs to be cut to disable the jumper, and can be closed again by creating a solder bridge between the two pads.
SJ2 = microbuilder:SOLDERJUMPER_2WAY: 2-Way Solder Jumper
U$1 = pins_fine_pitch:1X5_ROUND
U$7 = osram_opto_LED:LRTB_R48G
U$27 = pins_fine_pitch:1X7_ROUND
USB = femtoduino:USB_MICROB: This is the hirose ZX62-B-5PA(11) MICRO-USB B Type female connection.
X1 = crystals:FA-128
X2 = crystals:ABS06-107-32.768KHZ-T: ABS06-107-32.768kHz-T Crystal Oscillator

## Board
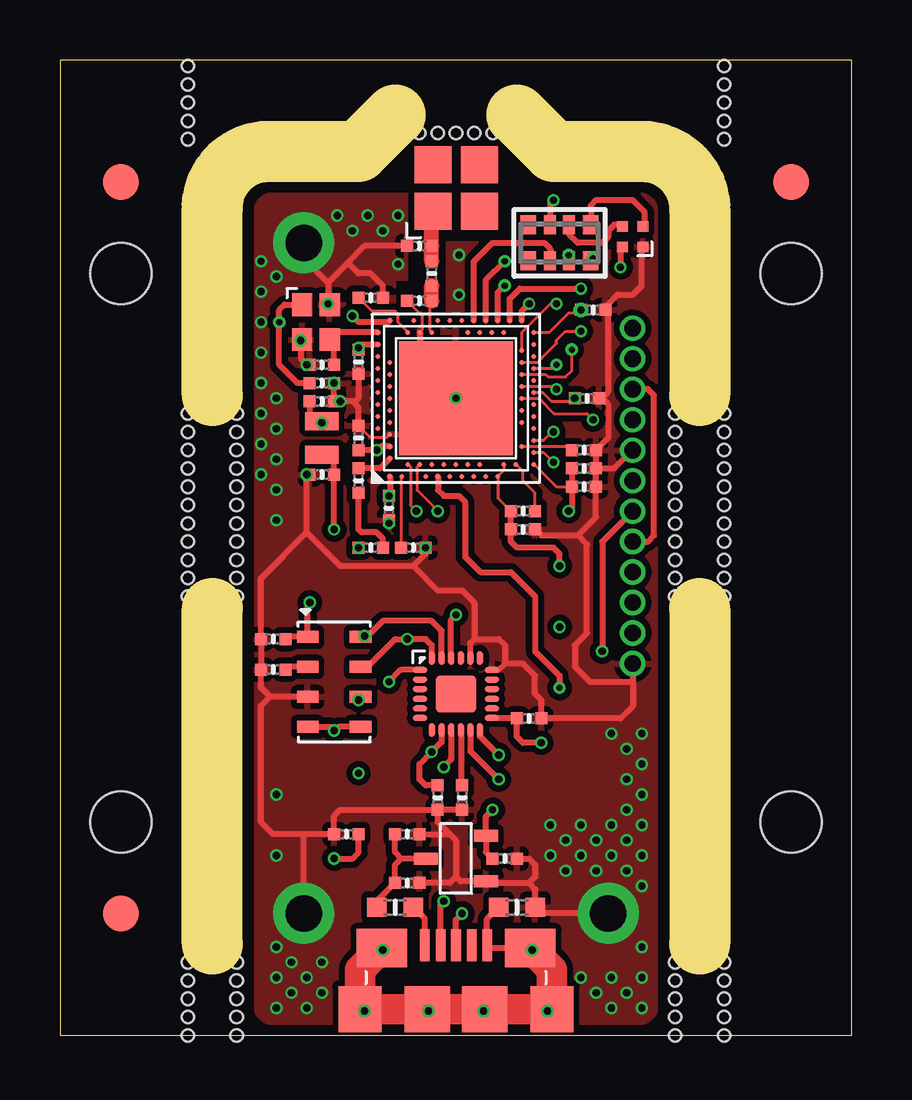
[diagram p2: board, top side]
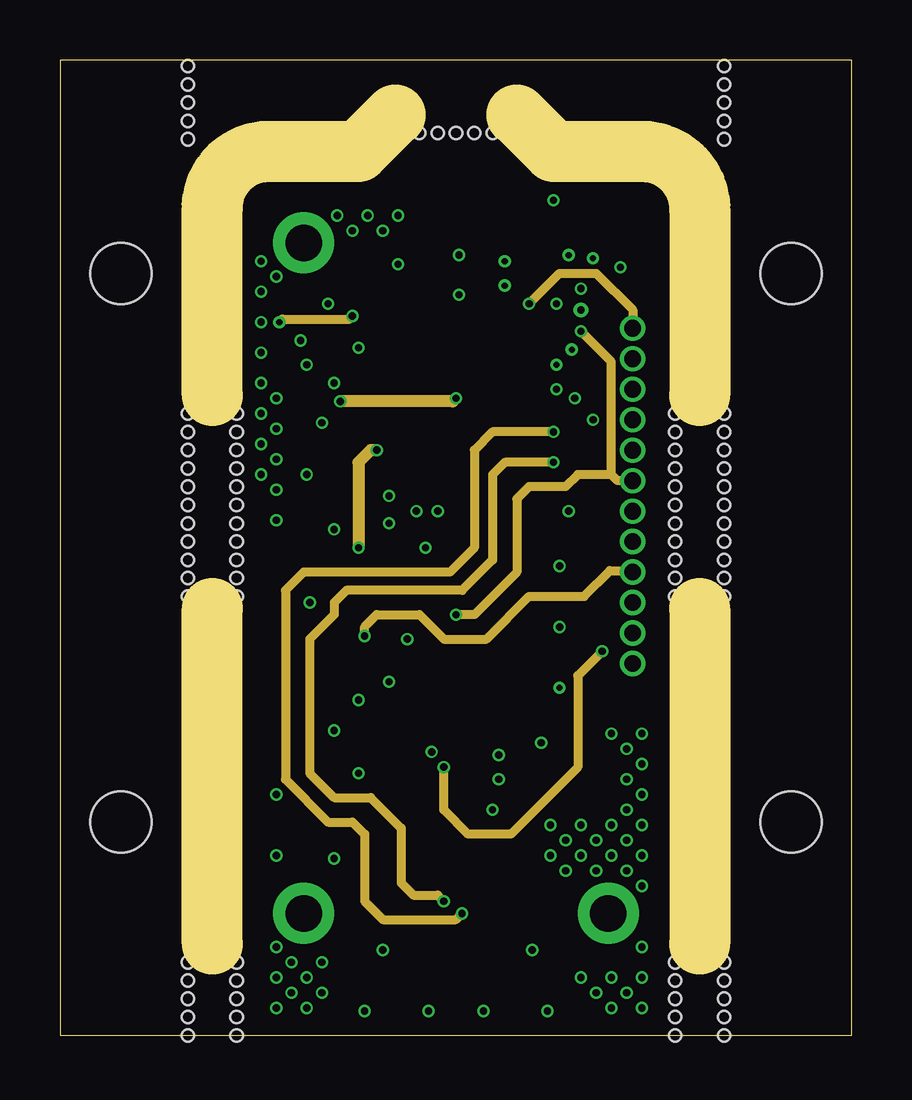
[diagram p3: board, inner layer Route2]
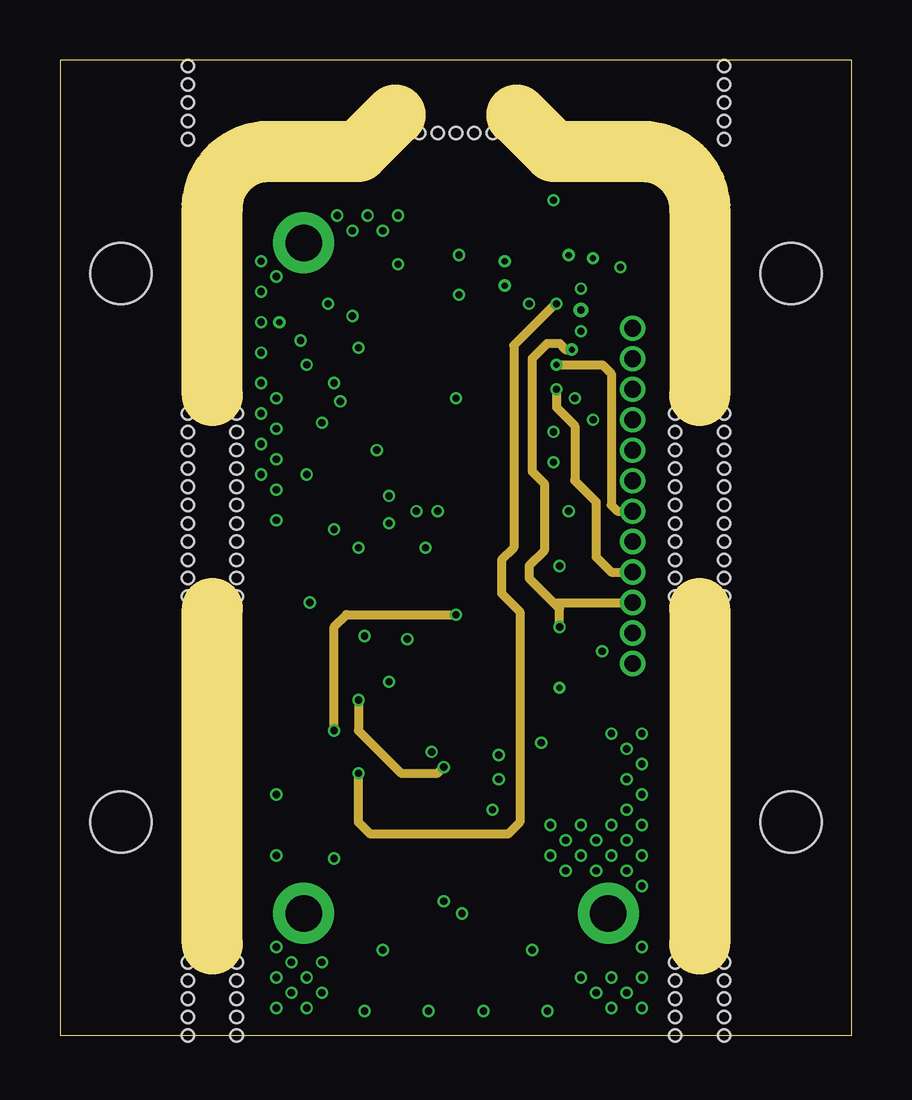
[diagram p4: board, inner layer Route15]
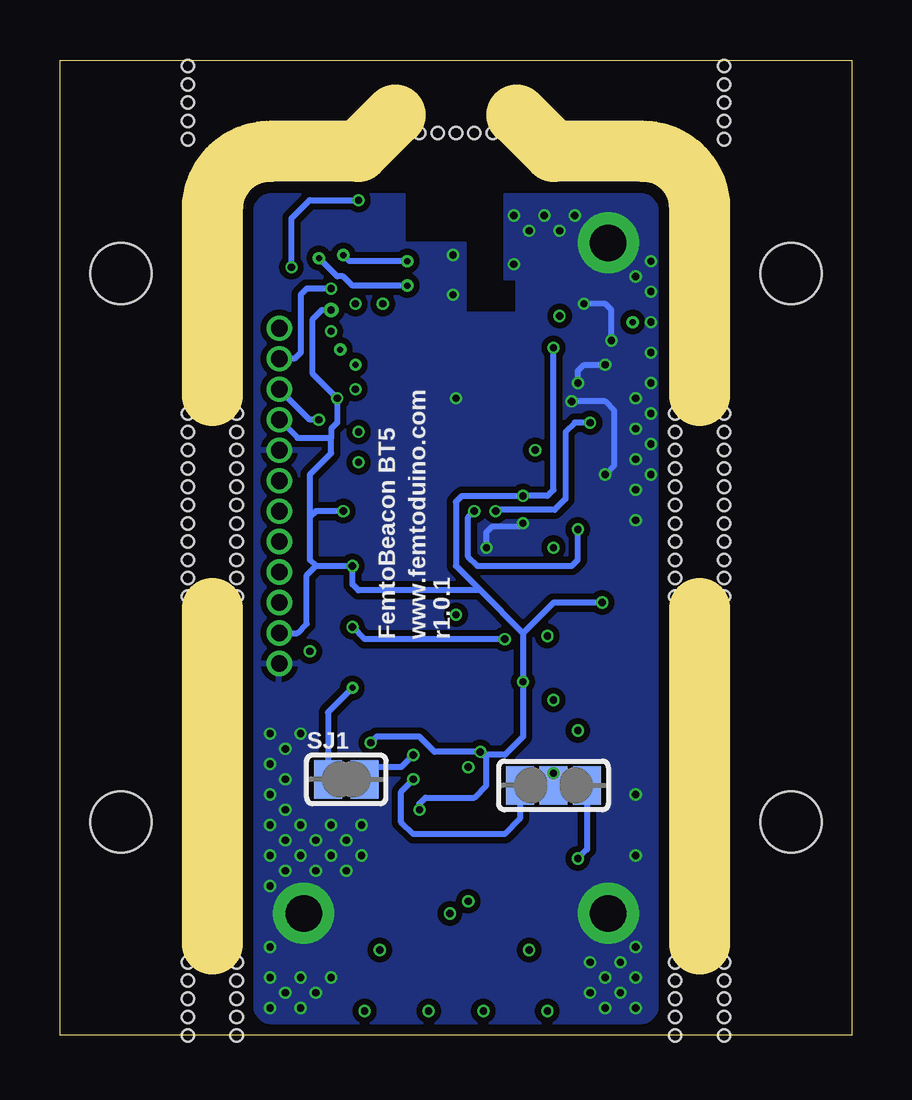
[diagram p5: board, bottom side, seen from below]

Size 33.02 x 40.64 mm. Coordinates in mm from the lower left corner, seen from the top.
Outline: 0,40.64 0,0 33.02,0 33.02,40.64 0,40.64
Copper layers (1*2*15*16): Top 0.035559375mm / dielectric 0.17018125mm / Route2 0.01778125mm / dielectric 47mil / Route15 0.01778125mm / dielectric 0.17018125mm / Bottom 0.035559375mm
Design rules "OSHPark-4layer *": minimum track width 5mil, minimum drill 10mil, track to track 5mil, track to pad 5mil, pad to pad 5mil, via to via 5mil, smd to smd 5mil, copper to edge 15mil, drill to drill 6mil, minimum pad ring 4mil, minimum via ring 4mil, stop-mask expansion 2mil, vias tented up to drill 25mil, thermal gap 10mil
Holes 0.51 mm at 18.03,37.59 17.27,37.59 16.51,37.59 15.75,37.59 14.99,37.59 7.37,0 7.37,0.76 7.37,0.76 7.37,1.52 7.37,1.52 7.37,2.29 7.37,3.05 25.65,0 25.65,0.76 25.65,1.52 25.65,2.29 25.65,3.05 7.37,18.29 7.37,19.05 7.37,19.81 7.37,19.81 7.37,20.57 7.37,21.34 7.37,22.1 7.37,22.86 7.37,22.86 7.37,23.62 7.37,24.38 7.37,25.15 7.37,25.91 25.65,18.29 25.65,19.05 25.65,19.81 25.65,19.81 25.65,20.57 25.65,21.34 25.65,22.1 25.65,22.86 25.65,23.62 25.65,24.38 25.65,25.15 25.65,25.91 25.65,25.91 5.33,18.29 5.33,19.05 5.33,19.81 5.33,20.57 5.33,21.34 5.33,22.1 5.33,22.86 5.33,23.62 5.33,24.38 5.33,25.15 5.33,25.91 27.69,18.29 27.69,19.05 27.69,19.05 27.69,19.81 27.69,20.57 27.69,21.34 27.69,22.1 27.69,22.86 27.69,23.62 27.69,24.38 27.69,25.15 27.69,25.91 5.33,3.05 5.33,2.29 5.33,1.52 5.33,0.76 5.33,0 27.69,3.05 27.69,2.29 27.69,1.52 27.69,0.76 27.69,0 5.33,37.34 5.33,38.1 5.33,38.86 5.33,38.86 5.33,39.62 5.33,40.39 27.69,37.34 27.69,38.1 27.69,38.1 27.69,38.86 27.69,39.62 27.69,40.39
Holes 2.54 mm at 2.54,31.75 2.54,8.89 30.48,8.89 30.48,31.75
Milling: 10 lines

### Footprints (pad centres in the part's own frame; a part is rotated, then mirrored left to right if it is on the bottom)
0479480001 = smd 1.54 x 1.54: ANT -0.963,0.963; NC1 0.978,0.963; NC2 0.978,-0.978; NC3 -0.963,-0.978
MS5611-01BA03 = smd 0.9 x 0.5: 1 -1.1,1.875; 2 -1.1,0.625; 3 -1.1,-0.625; 4 -1.1,-1.875; 5 1.1,-1.875; 6 1.1,-0.625; 7 1.1,0.625; 8 1.1,1.875
_0402MP = smd 0.5 x 0.5: 1 -0.508,0; 2 0.508,0
_0603MP = smd 0.8 x 0.8: 1 -0.762,0; 2 0.762,0
FIDUCIAL_1MM = smd 1.5 x 1.5: 1 0,0
NRF52840 = smd 0.21 x 0.21: A8 -1.25,3.25; A10 -0.75,3.25; A12 -0.25,3.25; A14 0.25,3.25; A16 0.75,3.25; A18 1.25,3.25; A20 1.75,3.25; A22 2.25,3.25; A23 2.75,3.25; AA24 3.25,-2.25; AB2 -2.75,-2.5; AC5 -2,-2.75; AC9 -1,-2.75; AC11 -0.5,-2.75; AC13 0,-2.75; AC15 0.5,-2.75; AC17 1,-2.75; AC19 1.5,-2.75; AC21 2,-2.75; AC24 3.25,-2.75; AD2 -2.75,-3.25; AD4 -2.25,-3.25; AD6 -1.75,-3.25; AD8 -1.25,-3.25; AD10 -0.75,-3.25; AD12 -0.25,-3.25; AD14 0.25,-3.25; AD16 0.75,-3.25; AD18 1.25,-3.25; AD20 1.75,-3.25; AD22 2.25,-3.25; AD23 2.75,-3.25; B1 -3.25,2.75; B3 -2.5,2.75; B5 -2,2.75; B7 -1.5,2.75; B9 -1,2.75; B11 -0.5,2.75; B13 0,2.75; B15 0.5,2.75; B17 1,2.75; B19 1.5,2.75; B24 3.25,2.75; C1 -3.25,2.25; D2 -2.75,2; D23 2.75,2; E24 3.25,1.75; F2 -2.75,1.5; F23 2.75,1.5; G1 -3.25,1.25; H2 -2.75,1; H23 2.75,1; J1 -3.25,0.75; J24 3.25,0.75; K2 -2.75,0.5; L1 -3.25,0.25; L24 3.25,0.25; M2 -2.75,0; N1 -3.25,-0.25; N24 3.25,-0.25; P2 -2.75,-0.5; P23 2.75,-0.5; R1 -3.25,-0.75; R24 3.25,-0.75; T2 -2.75,-1; T23 2.75,-1; U1 -3.25,-1.25; U24 3.25,-1.25; V23 2.75,-1.5; W1 -3.25,-1.75; W24 3.25,-1.75; Y2 -2.75,-2; Y23 2.75,-2 | smd 4.75 x 4.75: VSS 0,0
QFN_3X3MM = smd 0.6 x 0.25: P$1 -1.5,1; P$2 -1.5,0.6; P$3 -1.5,0.2; P$4 -1.5,-0.2; P$5 -1.5,-0.6; P$6 -1.5,-1; P$13 1.5,-1; P$14 1.5,-0.6; P$15 1.5,-0.2; P$16 1.5,0.2; P$17 1.5,0.6; P$18 1.5,1 | smd 0.25 x 0.6: P$7 -1,-1.5; P$8 -0.6,-1.5; P$9 -0.2,-1.5; P$10 0.2,-1.5; P$11 0.6,-1.5; P$12 1,-1.5; P$19 1,1.5; P$20 0.6,1.5; P$21 0.2,1.5; P$22 -0.2,1.5; P$23 -0.6,1.5; P$24 -1,1.5 | smd 1.7 x 1.54: P$25 0,0
MCP1700T-3302E/TT = smd 0.5 x 1: GND -0.95,-1.25; VIN 0,1.25; VOUT 0.95,-1.25
RESPACK_4X0603 = smd 0.65 x 0.8: 1 -1.3,-0.75; 4 1.3,-0.75; 5 1.3,0.75; 8 -1.3,0.75 | smd 0.5 x 0.8: 2 -0.4,-0.75; 3 0.4,-0.75; 6 0.4,0.75; 7 -0.4,0.75
SOLDERJUMPER_CLOSEDWIRE = smd 1.168 x 1.6: 1 -0.762,0; 2 0.762,0 | smd 0.635 x 0.203: WIRE 0,0
SOLDERJUMPER_2WAY_OPEN_NOPASTE = smd 1.168 x 1.6: 1 -1.397,0; 2 1.397,0; 3 0,0
1X5_ROUND = drill 0.7 pad 1: P$1 0,0; P$2 0,-1.27; P$3 0,-2.54; P$4 0,-3.81; P$5 0,-5.08
LRTB_R48G = smd 0.45 x 0.45: 1 0.425,0.425; 2 0.425,-0.425; 3 -0.425,-0.425; 4 -0.425,0.425
1X7_ROUND = drill 0.7 pad 1: P$1 0,0; P$2 0,-1.27; P$3 0,-2.54; P$4 0,-3.81; P$5 0,-5.08; P$6 0,-6.35; P$7 0,-7.62
USB_MICROB_PACKAGE = smd 0.4 x 1.35: 1 -1.3,1.47; 2 -0.64,1.47; 3 0,1.47; 4 0.66,1.47; 5 1.3,1.47 | smd 2.1 x 1.6: 6 -3.1,1.35; 11 3.1,1.35 | smd 1.8 x 1.9: 7 -4,-1.2; 10 4,-1.2 | smd 1.9 x 1.9: 8 -1.2,-1.2; 9 1.2,-1.2
FA-128 = smd 0.95 x 0.85: 1 -0.725,-0.575; 2 0.725,-0.575; 3 0.725,0.575; 4 -0.725,0.575
ABS06-107-32.768KHZ-T = smd 0.75 x 1.4: 1 -0.7,0; 2 0.7,0

### Placement (x,y rotation side)
ANT  16.51,35.31 90 top
BARO  11.43,14.73 0 top
C1  10.92,27.18 0 top
C2  10.92,27.94 0 top
C3  14.99,30.61 0 top
C4  14.99,32.89 0 top
C5  14.73,20.32 0 top
C6  19.3,21.08 0 top
C7  21.97,26.54 0 top
C8  22.23,30.23 0 top
C9  15.75,9.91 90 top
C10  16.76,9.91 90 top
C11  12.95,30.73 0 top
C12  12.45,28.07 90 top
C13  19.56,13.21 0 top
C14  13.72,21.97 90 top
C15  12.45,24.89 90 top
C16  10.92,23.37 0 top
C17  10.92,26.42 0 top
C18  21.84,23.62 0 top
C19  21.84,24.38 0 top
C20  21.84,22.86 0 top
C21  18.54,7.37 0 top
C22  14.48,6.35 0 top
C23  14.48,8.38 0 top
C24  8.89,16.51 0 top
FB1  13.97,5.33 0 top
FB2  19.05,5.33 0 top
FID1  2.54,5.08 0 top
FID2  2.54,35.56 0 top
FID3  30.48,35.56 0 top
IC  16.51,26.54 90 top
IMU  16.51,14.22 0 top
L1  15.49,31.75 90 top
L2  12.45,23.11 90 top
L3  12.95,20.32 0 top
L4  19.3,21.84 0 top
LDO_VREG  16.51,7.37 90 top
R1  11.94,8.38 0 top
R2  8.89,15.24 0 top
RES1  20.83,33.02 0 top
SJ1  21.08,10.67 0 bottom
SJ2  12.45,10.41 180 bottom
U$1  23.88,24.38 180 top
U$7  23.88,33.27 270 top
U$27  23.88,15.49 180 top
USB  16.51,2.29 0 top
X1  10.67,29.72 270 top
X2  10.92,24.89 90 top

### Tracks (layer width: path | path; a pad name or v marks a point on that pad's centre or on a via)
ANT
  Top 0.127: IC.H23 15.42,29.39 15.42,30.53 C3.2
  Top 0.635: C3.2 L1.1
BLUE  (via drill 0.25 pad 0.51)
  Top 0.254: IC.W24 18.26,30.96 v18.54,31.24 | RES1.4 22.14,32.26 v22.23,32.38
  Bottom 0.254: v18.54,31.24 20.83,31.24 21.21,31.62 21.46,31.62 v22.23,32.38
CS  (via drill 0.3 pad 0.51)
  Top 0.127: IC.AC19 19.91,28.04 20.7,28.83 20.7,28.96 21.08,29.34 v21.72,29.34
  Top 0.254: BARO.4 11.27,12.86 v11.43,12.7 11.59,12.86 BARO.5 | IMU.P$22 16.31,17.33 v16.51,17.53
  Route2 0.381: U$27.P$7 23.24,23.11 22.99,23.37 | 22.99,23.37 22.99,28.07 v21.72,29.34 | 22.99,23.37 21.59,23.37 21.08,22.86 19.56,22.86 19.05,22.35 19.05,19.3 17.27,17.53 v16.51,17.53
  Route15 0.381: v11.43,12.7 11.43,17.02 11.94,17.53 v16.51,17.53
D23
  Top 0.127: IC.D23 14.51,29.3 14.1,29.72 14.1,30.05 13.97,30.18 13.01,30.18 C11.1
DCCH
  Top 0.127: L4.2 19.81,22.61 19.3,23.11 19.3,23.5 IC.AB2
DEC1
  Top 0.127: IC.C1 14.22,23.26 C5.1
DEC3V3
  Top 0.127: IC.AC5 21.18,24.54 C19.1
FSYNC  (via drill 0.3 pad 0.51)
  Top 0.254: IMU.P$11 17.11,11.85 v18.29,10.67
  Bottom 0.254: SJ2.2 13.84,9.02 14.48,8.38 18.29,8.38 18.8,8.89 18.8,10.16 v18.29,10.67
FSYNC_PIN  (via drill 0.3 pad 0.51)
  Top 0.127: IC.AC21 19.26,29.29 20.45,30.48 v20.7,30.48
  Route15 0.381: v20.7,30.48 20.66,30.48 18.92,28.75 18.92,20.32 18.41,19.81 18.41,18.41 19.18,17.65 19.18,8.89 18.67,8.38 12.95,8.38 12.45,8.89 v12.45,10.92
  Bottom 0.254: SJ2.3 v12.45,10.92
GND  (via drill 0.3 pad 0.51, 1.52 pad 2.54)
  Top 0.127: IC.F23 15.11,29.4 15.11,29.97 C3.1 | C15.2 12.93,24.92 13.63,24.92 IC.B7
  Top 0.254: IC.F23 15.01,27.69 16.03,26.67 IC.VSS | C6.2 20.07,20.83 21.59,20.83 | 21.59,20.83 22.35,21.59 C20.2 C18.2 | X1.4 11.21,30.44 v11.18,30.48 11.18,31.37 | X1.2 10.07,28.99 v10.03,28.96 10.03,28.19 v10.29,27.94 C2.1 | C1.2 C17.2 v11.68,26.42 12.19,26.42 | C16.1 v10.29,23.37 10.29,20.95 | C4.1 12.7,32.89 12,32.19 | 12,32.19 11.18,31.37 | C12.1 12.45,26.54 12.32,26.42 12.19,26.42 | C18.2 23.11,23.62 U$1.P$1 | C18.2 C19.2 22.86,24.89 22.86,26.29 22.61,26.54 | 10.29,20.95 11.68,19.56 14.73,19.56 | U$7.1 24.26,32.8 24.26,31.24 23.88,30.86 23.24,30.86 22.73,30.35 C8.2 22.86,30.1 22.86,26.8 22.61,26.54 | 21.59,20.83 21.97,20.45 21.97,16.76 21.46,16.26 21.46,15.37 22.1,14.73 23.88,14.73 | C23.2 16.26,8.38 | 16.26,8.38 16.51,8.13 16.51,6.6 | 16.51,6.6 16.26,6.35 C22.2 | 16.51,6.6 16.7,6.42 LDO_VREG.GND 17.83,6.35 19.56,6.35 | 19.56,6.35 19.81,6.1 FB2.2 20.07,5.08 v22.86,5.08 | C21.2 19.56,7.37 19.81,7.11 19.81,6.6 19.56,6.35 | 14.73,19.56 15.24,20.07 C5.2 | C15.2 12.45,26.16 12.19,26.42 | C14.1 v13.72,21.34 | C11.2 13.46,31.24 12.95,31.75 12.45,31.75 12,32.19 | BARO.3 8.75,14.11 | 8.75,14.11 8.38,14.48 R2.1 C24.1 8.38,19.05 10.29,20.95 | C9.1 15.75,8.89 16.26,8.38 | C10.1 C9.1 | IMU.P$20 17.11,16.35 17.27,16.51 | 17.27,16.51 18.29,16.51 18.54,16.26 18.54,15.49 | 18.54,15.49 18.27,15.22 IMU.P$18 | 10.16,8.38 R1.1 11.43,9.14 11.68,9.4 C9.1 | 10.16,8.38 8.89,8.38 8.38,8.89 8.38,13.74 8.75,14.11 | C7.2 22.61,26.54 | 14.73,19.56 15.75,18.54 16.76,18.54 17.27,18.03 17.27,16.51 | U$27.P$1 23.88,14.73 | 23.88,14.73 23.88,13.72 23.37,13.21 C13.2 20.07,13.97 19.81,14.22 19.81,14.99 19.3,15.49 18.54,15.49 | v10.16,33.02 10.16,32.38 11.18,31.37
  Top 0.254: v10.16,5.08 10.16,8.38
  Route2 0.508: IC.VSS 16.38,26.42 v11.68,26.42
  Bottom 0.254: v10.03,28.96 10.03,30.23 10.29,30.48 v11.18,30.48 | C1.2 11.43,27.69 11.18,27.94 v10.29,27.94 | v10.29,23.37 9.91,23.75 9.91,26.04 10.29,26.42 v11.68,26.42 | C5.2 15.24,20.95 14.99,21.21 13.84,21.21 v13.72,21.34
  other vias: 16.51,26.54 11.43,27.18 15.24,20.32 14.1,34.16 12.83,34.16 11.56,34.16 9.02,31.62 9.02,26.54 9.02,25.27 9.02,24 9.02,22.73 9.02,21.46 9.02,10.03 9.02,7.49 9.02,3.68 9.02,2.41 9.02,1.14 10.29,1.14 10.29,2.41 22.99,1.14 24.26,1.14 24.26,2.41 22.99,2.41 24.26,3.68 24.26,6.22 24.26,7.49 22.99,7.49 21.72,7.49 20.45,7.49 20.45,8.76 21.72,8.76 22.99,8.76 24.26,8.76 24.26,10.03 24.26,11.3 24.26,12.57 22.99,12.57 12.19,33.53 13.46,33.53 8.38,25.91 8.38,24.64 8.38,23.37 8.38,27.18 8.38,28.45 8.38,29.72 8.38,30.99 8.38,32.26 9.65,1.78 9.65,3.05 10.92,3.05 10.92,1.78 23.62,1.78 22.35,1.78 21.72,2.41 21.08,8.13 22.35,8.13 21.08,6.86 22.35,6.86 23.62,6.86 23.62,8.13 23.62,9.4 23.62,10.67 23.62,11.94 16.64,32.51 14.1,32.13 16.64,30.86
  pour Bottom (isolate 0.254): 14.48,35.05 8.85,35.05 arc90 8.13,34.33 8.13,1.23 arc90 8.85,0.51 24.17,0.51 arc90 24.89,1.23 24.89,34.33 arc90 24.17,35.05 18.67,35.05 18.67,33.02 16.13,33.02 16.13,30.1 13.97,30.1 13.97,31.5 14.48,31.5
  pour Top (isolate 0.254): 14.48,35.05 8.85,35.05 arc90 8.13,34.33 8.13,1.23 arc90 8.85,0.51 24.17,0.51 arc90 24.89,1.23 24.89,34.33 arc90 24.17,35.05 18.67,35.05 18.67,33.02 16.13,33.02 16.13,30.1 13.97,30.1 13.97,31.5 14.48,31.5
GND_IN
  Top 0.254: USB.11 17.93,3.64 USB.5 17.81,4.86 FB2.1
  Top 1.27: USB.6 12.51,2.74 USB.7 USB.8 USB.9 USB.10 20.51,2.74 USB.11
GREEN  (via drill 0.25 pad 0.51)
  Top 0.254: IC.U24 17.76,31.48 v18.54,32.26 | RES1.3 21.23,32.37 v21.21,32.51
  Bottom 0.254: v18.54,32.26 20.95,32.26 v21.21,32.51
INT  (via drill 0.3 pad 0.51)
  Top 0.254: IMU.P$12 17.51,12.46 v18.29,11.68
  Bottom 0.254: v18.29,11.68 18.8,11.18 19.81,11.18 SJ1.2
INT_WAKE  (via drill 0.25 pad 0.51)
  Top 0.254: IC.J1 15.76,22.72 16,22.48 16.64,22.48 16.89,22.23 16.89,19.94 17.53,19.3 18.8,19.3 19.81,18.29 19.81,16 20.83,14.99 v20.83,14.48
  Bottom 0.254: v20.83,14.48 21.84,13.46 SJ1.1
MISO  (via drill 0.25 pad 0.51, 0.3 pad 0.51)
  Top 0.127: IC.AD18 20.55,27.79 v20.7,27.94
  Top 0.254: IMU.P$9 16.31,11.48 v16,11.18 | BARO.6 12.53,14.05 v12.45,13.97 | U$27.P$6 22.61,20.57 v22.61,16
  Route2 0.381: v22.61,16 21.59,14.99 21.59,11.18 18.8,8.38 17.02,8.38 16,9.4 v16,11.18
  Route15 0.381: v20.7,27.94 22.61,27.94 22.99,27.56 22.99,22.1 23.24,21.84 U$27.P$6 | v12.45,13.97 12.45,12.7 14.22,10.92 15.75,10.92 v16,11.18
MOSI  (via drill 0.25 pad 0.51, 0.3 pad 0.51)
  Top 0.127: IC.AC17 20.23,27.54 20.34,27.43 21.08,27.43 21.34,27.69 v21.34,28.57
  Top 0.254: BARO.7 12.82,15.36 13.97,16.51 v14.48,16.51 15.24,16.51 15.49,16.26 15.49,15.74 IMU.P$24
  Route15 0.381: 20.57,18.03 19.56,19.05 19.56,19.56 20.19,20.19 20.19,22.99 19.68,23.5 19.68,28.19 20.32,28.83 20.83,28.83 21.08,28.57 v21.34,28.57 | 20.57,18.03 U$27.P$3 | v20.83,17.02 20.83,17.78 20.57,18.03
  Bottom 0.254: v14.48,16.51 20.32,16.51 v20.83,17.02
N$1
  Top 0.254: USB.1 15.21,4.86 FB1.2
N$6  (via drill 0.3 pad 0.51)
  other vias: 15.37,1.02
N$7  (via drill 0.3 pad 0.51)
  other vias: 17.65,1.02
N$8  (via drill 0.3 pad 0.51)
  other vias: 13.46,3.56
N$9  (via drill 0.3 pad 0.51)
  other vias: 19.68,3.56
N$10  (via drill 0.3 pad 0.51)
  other vias: 12.7,1.02
N$11  (via drill 0.3 pad 0.51)
  other vias: 20.32,1.02
N$12
  Top 0.254: U$7.4 24.38,33.78 24.38,34.29 23.88,34.8 22.35,34.8 22.13,34.57 RES1.5
N$13
  Top 0.254: U$7.3 23.37,33.78 23.11,33.78 22.86,33.53 22.86,33.27 22.61,33.02 21.59,33.02 21.23,33.38 RES1.6
N$14  (via drill 0.3 pad 0.51)
  Top 0.254: U$7.2 23.37,32.77 v23.37,32 | v20.57,34.8 20.43,34.65 RES1.7
  Bottom 0.254: v23.37,32 23.37,34.04 22.61,34.8 v20.57,34.8
N$20
  Top 0.254: IC.B3 13.34,23.62 L2.2
N$21
  Top 0.254: L3.2 13.46,20.7 13.21,20.95 12.57,20.95 12.45,21.08 L2.1
N$22  (via drill 0.3 pad 0.51)
  Top 0.254: IC.B5 13.37,24.54 v13.21,24.38 C15.1
  Route2 0.508: v13.21,24.38 12.95,24.38 12.45,23.88 L3.1
  other vias: 12.45,20.32
N$23  (via drill 0.3 pad 0.51)
  Top 0.254: v11.43,7.37 12.19,7.37 12.45,7.62 R1.2
  Bottom 0.254: SJ2.1 11.05,7.75 v11.43,7.37
N$25
  Top 0.254: IMU.P$10 16.71,10.47 C10.2
P0.18/RESET  (via drill 0.3 pad 0.51)
  Top 0.127: IC.AC13 19.96,26.54 20.6,25.91 21.97,25.91 v22.23,25.65
  Top 0.254: U$27.P$5 24.51,20.57 24.77,20.83 24.77,26.67 24.51,26.92 U$1.P$3
  Bottom 0.254: v22.23,25.65 22.61,25.65 U$1.P$3
PS
  Top 0.254: BARO.2 9.52,15.36 R2.2
RED
  Top 0.254: IC.R24 17.26,32.25 18.03,33.02 20.19,33.02 20.45,32.77 20.45,32.29 RES1.2
RF
  Top 0.635: L1.2 C4.2 15.49,34.04 ANT.ANT
SCK  (via drill 0.3 pad 0.51)
  Top 0.127: IC.AC15 20.58,27.04 v20.7,26.92
  Top 0.254: IMU.P$23 15.91,16.86 15.49,17.27 13.46,17.27 12.8,16.61 12.86,16.61 v12.7,16.64 12.67,16.61 BARO.8
  Route2 0.381: v12.7,16.64 12.7,17.02 13.21,17.53 14.99,17.53 16,16.51 17.78,16.51 19.56,18.29 21.84,18.29 22.92,19.37 23.81,19.37 U$27.P$4
  Route15 0.381: v20.7,26.92 20.7,26.16 21.46,25.4 21.46,23.11 22.35,22.23 22.35,19.94 22.99,19.3 U$27.P$4
SWDCLK  (via drill 0.3 pad 0.51)
  Top 0.254: IC.AA24 18.76,30.7 19.18,31.11 v21.72,31.11
  Bottom 0.254: v21.72,31.11 22.73,31.11 22.99,30.86 22.99,28.45 23.24,28.19 U$1.P$4
SWDIO  (via drill 0.3 pad 0.51)
  Top 0.254: IC.AC24 19.26,30.18 v19.56,30.48
  Route2 0.381: v19.56,30.48 20.83,31.75 22.35,31.75 23.88,30.23 U$1.P$5
USB_DM  (via drill 0.3 pad 0.51)
  Top 0.127: IC.AD4 20.16,24.29 v20.57,23.88
  Top 0.254: USB.2 15.87,5.46 v16,5.59
  Route2 0.381: v20.57,23.88 18.54,23.88 18.03,23.37 18.03,19.81 16.76,18.54 11.94,18.54 11.43,18.03 11.43,17.53 10.41,16.51 10.41,10.92 11.43,9.91 12.95,9.91 14.22,8.64 14.22,6.35 14.73,5.84 15.75,5.84 v16,5.59
USB_DP  (via drill 0.3 pad 0.51)
  Top 0.127: IC.AD6 20.16,24.79 20.51,25.15 v20.57,25.15
  Top 0.254: USB.3 16.51,4.83 v16.76,5.08
  Route2 0.381: v20.57,25.15 18.03,25.15 17.27,24.38 17.27,20.32 16.26,19.3 10.16,19.3 9.4,18.54 9.4,10.67 11.18,8.89 12.19,8.89 12.7,8.38 12.7,5.59 13.46,4.83 16.51,4.83 v16.76,5.08
VDD  (via drill 0.3 pad 0.51, 0.3 pad 0.61)
  Top 0.127: L4.1 18.29,22.35 18.29,23.27 IC.W1 18.51,23.54 IC.Y2 | IC.AD14 20.12,26.79 20.5,26.42 21.34,26.42 C7.1 | IC.AD2 20.69,22.86 C20.1 | IC.AD23 20.4,29.29 21.21,30.1 21.59,30.1 C8.1
  Top 0.254: v20.83,19.56 20.83,20.07 20.57,20.32 19.05,20.32 18.8,20.57 C6.1 L4.1 | IC.A22 12.59,28.79 v12.45,28.65 C12.2 | C21.1 17.76,7.64 LDO_VREG.VOUT 17.76,9.12 v18.03,9.4 | IC.B1 13.76,22.52 C14.2 | v21.21,21.84 21.34,21.97 C20.1 C18.1 | C24.2 9.49,16.61 BARO.1 10.33,17.95 v10.41,18.03 | IMU.P$13 19.03,13.22 C13.1 19.05,12.45 19.3,12.19 v20.07,12.19 | IMU.P$8 15.91,12.23 v15.49,11.81 14.99,11.3 14.99,10.67 15.24,10.41 C9.2 | IMU.P$1 14.21,15.22 v13.72,14.73
  Bottom 0.254: v12.45,28.65 12.45,22.73 12.7,22.48 C14.2 16.26,22.48 16.51,22.23 16.51,19.56 15.49,18.54 | 15.49,18.54 20.57,18.54 20.83,18.8 v20.83,19.56 22.35,19.56 | 22.61,21.59 22.61,23.37 21.72,24.26 21.72,24.89 | 22.61,21.59 22.61,19.81 22.35,19.56 | U$1.P$2 23.11,24.89 21.72,24.89 | 21.72,24.89 21.72,25.27 21.46,25.53 C7.1 22.48,27.56 22.48,29.84 22.1,30.23 C8.1 | U$27.P$2 23.11,16.76 22.73,17.14 22.73,19.18 22.35,19.56 | v21.21,21.84 22.35,21.84 22.61,21.59 | v18.03,9.4 18.03,9.65 17.78,9.91 15.75,9.91 15.24,10.41 15.24,11.56 v15.49,11.81 | v10.41,18.03 12.45,18.03 13.72,16.76 | 13.72,16.76 v13.72,14.73 13.72,12.45 14.48,11.68 15.37,11.68 v15.49,11.81 | 15.49,18.54 13.72,16.76 | v15.49,11.81 17.4,11.81 18.03,12.45 19.81,12.45 v20.07,12.19
  other vias: 21.72,30.23 21.46,26.54 13.72,22.48
VIN
  Top 0.254: LDO_VREG.VIN 14.22,7.37 | 14.22,7.37 13.97,7.62 C23.1 | 14.22,7.37 13.97,7.11 C22.1 13.21,5.59 FB1.1
XC1  (via drill 0.25 pad 0.51, 0.3 pad 0.51)
  Top 0.254: IC.B24 13.69,29.72 12.45,29.72 v12.19,29.97 | X1.1 9.36,30.44 9.14,30.23 v9.14,29.72 9.14,27.94 9.91,27.18 C1.1
  Route2 0.381: v9.14,29.72 9.27,29.84 12.06,29.84 v12.19,29.97
XC2
  Top 0.254: IC.A23 11.54,29.29 X1.3 11.43,28.81 C2.2
XL1  (via drill 0.3 pad 0.51)
  Top 0.127: IC.D2 14.61,23.7 14.61,22.1 v14.86,21.84
  Top 0.254: C17.1 10.41,25.78 10.73,25.78 X2.2 v10.92,25.53
  Bottom 0.254: v10.92,25.53 11.56,25.53 11.94,25.15 11.94,22.35 12.39,21.89 14.81,21.89 v14.86,21.84
XL2  (via drill 0.3 pad 0.51)
  Top 0.127: IC.F2 14.88,23.67 14.88,22.73 15.75,21.87 v15.75,21.84
  Top 0.254: X2.1 11.24,24.19 11.43,24 C16.2 v11.43,21.08
  Bottom 0.254: v11.43,21.08 11.43,19.81 11.68,19.56 15.62,19.56 16,19.94 16,21.59 v15.75,21.84

### Text on the board
bNames: r1.0.1 | www.femtoduino.com | FemtoBeacon BT5